# EAGLE design +Z SOLAR PANEL (EAGLE 8.7.0)
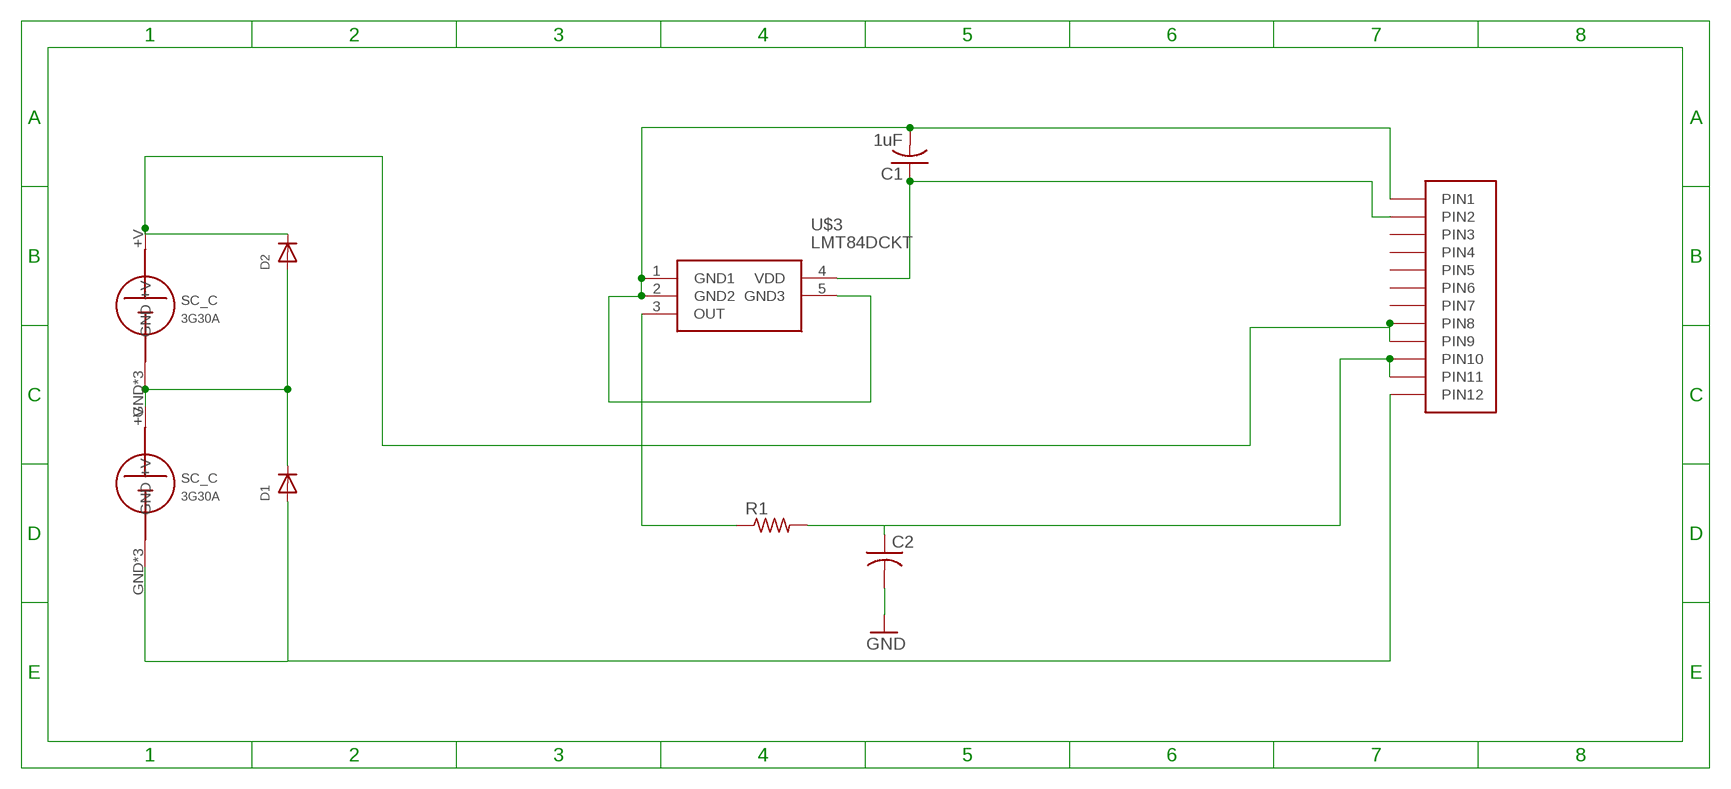
[diagram p0: schematic, sheet 1]

## Parts
C1  1uF  C-USC2012  [C2012]
C2  C-USC2012  [C2012]
D1  DIODE_SOD-123FL  [SOD-123FL]
D2  DIODE_SOD-123FL  [SOD-123FL]
R1  R-US_R0402  [R0402]
U$1  HEADER12PIN  [HEADER12PIN]
U$3  LMT84DCKT  [SOT65P210X110-5N]
U$4  SC_C  [SC_C]
U$5  SC_C  [SC_C]

## Nets
+V: D2.C U$1.P8(PIN8) U$1.P9(PIN9) U$4.+V
+VB: D1.C D2.A U$4.GND U$4.GND1(GND) U$4.GND2(GND) U$5.+V
GND: C1.2 C2.2 D1.A U$1.P1(PIN1) U$1.P12(PIN12) U$3.1(GND1) U$3.2(GND2) U$3.5(GND3) U$5.GND U$5.GND1(GND) U$5.GND2(GND)
N$3: C1.1 U$1.P2(PIN2) U$3.4(VDD)
N$5: R1.1 U$3.3(OUT)
N$6: C2.1 R1.2 U$1.P10(PIN10) U$1.P11(PIN11)
Unconnected: U$1.P3(PIN3) U$1.P4(PIN4) U$1.P5(PIN5) U$1.P6(PIN6) U$1.P7(PIN7)

## Library data of the parts
C1 C2 = adafruit:C-US: CAPACITOR, American symbol
D1 D2 = adafruit:DIODE: Diode SMADIODE - SMA Surface Mount Package 20V 1A Schottky Diode Digikey: 641-1014-6-ND DO-1N4148 - Through Hole Small Current Diode SOD-123 20V 1 A (.5mV Vf) Schottky Diode - Digikey: MBRX120TPMSCT-ND SOD-323 10V 570mA (.38mV Vf, 3ns) Schottky Diode - Digikey: ZLLS410CT-ND SOD-523 30V 30mA Schottky Diode (RB751S-40TE61) - Digikey: RB751S-40TE61CT-ND SOT23-R/W - SOT23 Package (R = Solder Paste/Reflow Ovens, W = Hand-Soldering) BAT54Film 40V 300mA - Digikey: 497-7162-1-ND
R1 = adafruit:R-US_: RESISTOR, American symbol
U$1 = BIRDS:HEADER12PIN
U$3 = LMT84DCKT:LMT84DCKT: 1.5V-Capable, 10 uA Analog Output Temperature Sensor in SC70 and TO-92 Source: Datasheet <http://uk.rs-online.com/web/p/products/8115860>; DESCRIPTION: 1.5V-Capable, 10 uA Analog Output Temperature Sensor in SC70 and TO-92; HEIGHT: 1.1mm; MANUFACTURER_NAME: Texas Instruments; MANUFACTURER_PART_NUMBER: LMT84DCKT; RS_PART_NUMBER: 8115860
U$4 U$5 = SC_C:SC_C

## Board
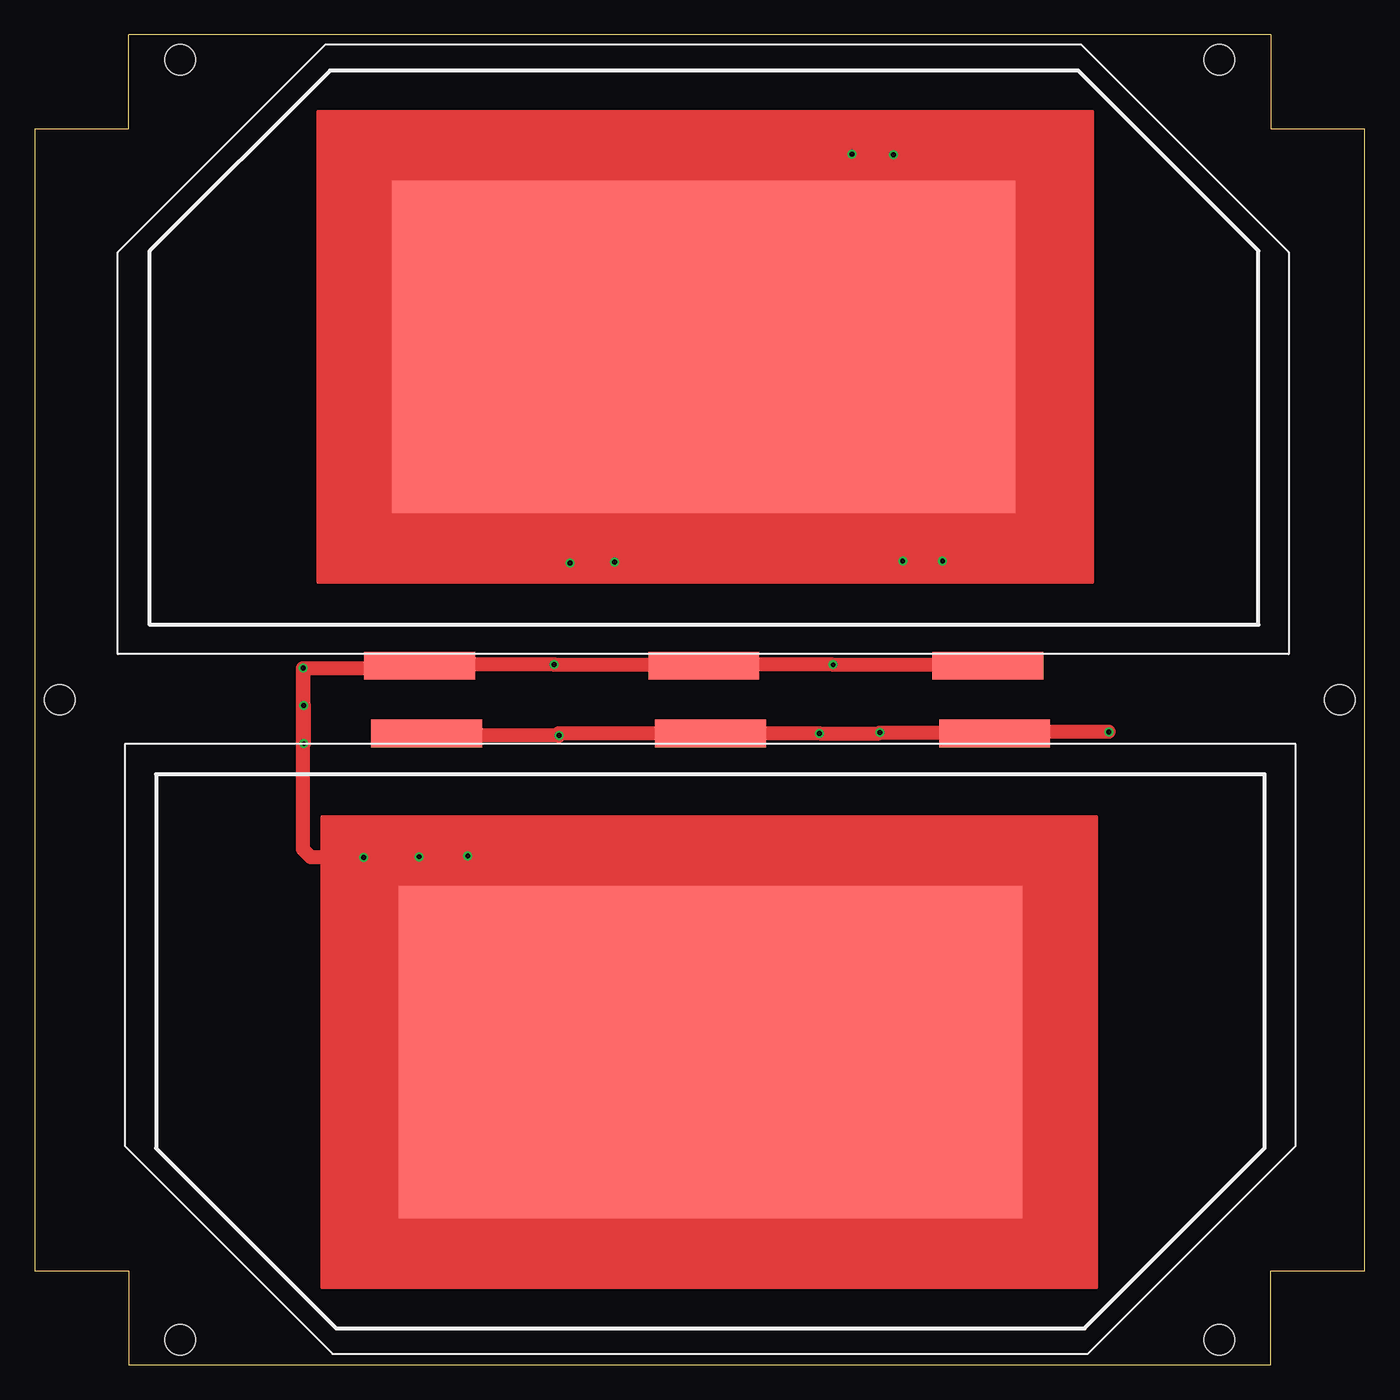
[diagram p1: board, top side]
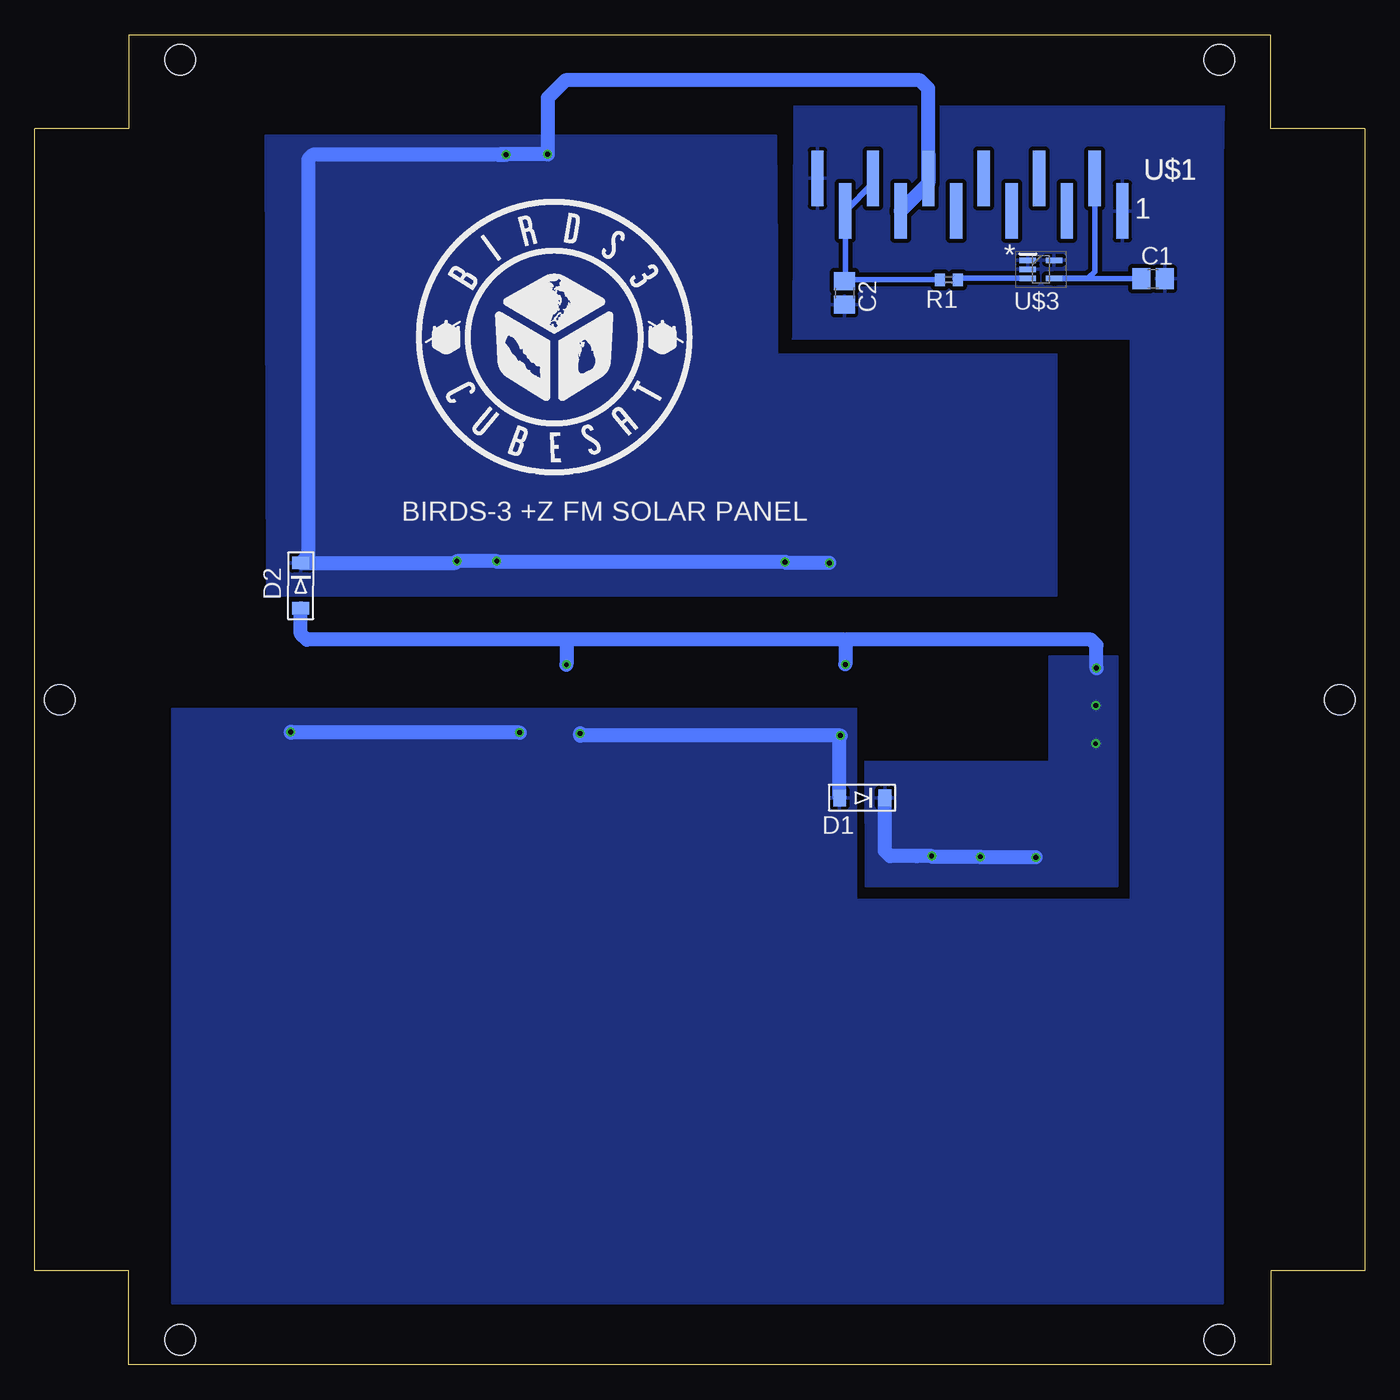
[diagram p2: board, bottom side, seen from below]

Size 96 x 96 mm. Coordinates in mm from the lower left corner, seen from the top.
Outline: 96,6.8 96,89.2 89.2,89.2 89.2,96 6.8,96 6.8,89.2 0,89.2 0,6.8 6.8,6.8 6.8,0 89.2,0 89.2,6.8 96,6.8
Copper layers (1*16): Top 0.035mm / dielectric 1.53mm / Bottom 0.035mm
Design rules "pban_5mil-l2": minimum track width 5mil, minimum drill 0.3mm, track to track 5mil, track to pad 0.229mm, pad to pad 5mil, via to via 5mil, smd to smd 5mil, copper to edge 0.5mm, drill to drill 0.5mm, minimum pad ring 0.15mm, minimum via ring 0.15mm, stop-mask expansion 4mil, vias tented up to drill 0.35mm, thermal gap 10mil
Holes 2.2 mm at 85.5,1.8 10.5,94.2 85.5,94.2 10.5,1.8 94.2,48 1.8,48

### Footprints (pad centres in the part's own frame; a part is rotated, then mirrored left to right if it is on the bottom)
C2012 = smd 1.3 x 1.5: 1 -0.85,0; 2 0.85,0
SOD-123FL = smd 0.91 x 1.22 bottom: A 1.637,0; C -1.637,0
R0402 = smd 0.7 x 0.9: 1 -0.65,0; 2 0.65,0
HEADER12PIN = smd 4 x 0.89: P1 0,0; P2 2.35,2; P3 0,4; P4 2.35,6; P5 0,8; P6 2.35,10; P7 0,12; P8 2.35,14; P9 0,16; P10 2.35,18; P11 0,20; P12 2.35,22
SOT65P210X110-5N = smd 1.2 x 0.4: 1 -0.95,0.65; 2 -0.95,0; 3 -0.95,-0.65; 4 0.95,-0.65; 5 0.95,0.65
SC_C = smd 45 x 24: +V 39.89,20.06 | smd 8 x 2: GND 39.89,-2.94; GND1 60.39,-2.94; GND2 19.39,-2.94

### Placement (x,y rotation side)
C1  15.29,78.38 0 bottom
C2  37.55,77.36 270 bottom
D1  36.27,40.92 0 top
D2  76.79,56.24 270 top
R1  30.02,78.31 180 bottom
U$1  17.5,83.27 90 bottom
U$3  23.38,79.06 0 bottom
U$4  8.4,53.4 0 top
U$5  88.67,42.63 180 top

### Tracks (layer width: path | path; a pad name or v marks a point on that pad's centre or on a via)
+V  (via drill 0.35)
  Top 0.305: U$4.+V 48.29,76.68 v58.98,87.37
  Bottom 1.016: 62.48,87.33 62.44,87.37 v58.98,87.37 58.98,91.42 57.7,92.7 32.1,92.7 31.5,92.1 U$1.P8 | 62.51,87.3 62.48,87.33 | 62.48,87.33 v61.99,87.33 75.93,87.33 76.26,87 76.26,58.41 D2.C 65.65,57.88 v65.53,58 v62.65,58 62.6,57.95 v41.84,57.95 41.76,57.87 v38.64,57.87 | 31.5,87.45 U$1.P8 | U$1.P8 31.5,85.27 U$1.P9
  pour Bottom (isolate 0.305): 42.42,80.19 42.43,72.93 22.26,72.95 22.25,55.49 79.23,55.47 79.33,88.74 42.51,88.74
+VB  (via drill 0.35)
  Top 0.305: U$5.+V 45.74,22.57
  Top 0.61: 68.72,50.53 U$4.GND1 | v57.63,50.53 57.56,50.46 | v19.37,50.29 19.54,50.46 | U$5.+V 34.63,36.72 v31.26,36.72
  Top 1.016: v23.75,36.63 19.94,36.63 19.36,37.21 v19.36,50.28 v19.37,50.29 | v19.37,50.29 27.62,50.29 U$4.GND2 27.88,50.55 v37.49,50.55 37.51,50.53 48.36,50.53 | 48.36,50.53 v57.63,50.53 68.72,50.53 69.63,50.53 69.78,50.68 | 48.36,50.53 U$4.GND | v19.37,50.29 19.37,47.59 v19.42,47.59 v19.42,44.83 v19.43,44.83
  Bottom 0.61: 19.49,50.41 v19.37,50.29 | 27.71,36.63 v27.75,36.67 | 31.21,36.67 v31.26,36.72
  Bottom 1.016: v23.75,36.63 27.71,36.63 | v27.75,36.67 31.21,36.67 | 32.36,36.72 v31.26,36.72 34.26,36.72 34.64,37.1 D1.C | v19.37,50.29 19.37,51.94 19.76,52.33 37.49,52.33 | 57.58,52.33 37.55,52.33 37.49,52.33 | 57.58,52.33 76.37,52.33 76.79,52.75 D2.A | 57.58,52.33 57.63,52.28 v57.63,50.53 | 37.49,52.33 v37.49,50.55
  pour Bottom: 22.81,51.12 22.82,43.52 36.08,43.56 36.06,34.55 17.83,34.55 17.82,51.12
GND  (via drill 0.35)
  Top 1.016: v77.52,45.68 69.28,45.68 69.28,45.63 | 69.28,45.63 U$5.GND2 | 69.28,45.63 v61,45.63 60.94,45.57 v56.63,45.57 U$5.GND | U$5.GND 47.63,45.57 47.63,45.54 48.78,45.54 U$5.GND | U$5.GND 37.84,45.57 v37.84,45.41 28.44,45.41 U$5.GND1
  Bottom 1.016: v56.63,45.57 56.63,45.41 v37.84,45.41 37.91,45.34 D1.A | v61,45.63 77.52,45.63 v77.52,45.68
  pour Bottom (isolate 0.305): 41.27,74.1 41.31,74.06 16.93,74.06 16.93,33.56 36.68,33.56 36.68,47.35 86.1,47.35 86.1,4.45 10.23,4.45 10.23,86.73 10.13,90.8 41.19,90.8
N$3
  Bottom 0.406: U$1.P2 19.5,78.9 19.99,78.41 U$3.4 22.4,78.38 C1.1
N$5
  Bottom 0.406: 29.59,78.41 R1.1 29.27,78.41 U$3.3
N$6
  Bottom 0.406: R1.2 37.45,78.31 C2.1 37.5,78.26 U$1.P11 35.5,85.27 U$1.P10

### Text on the board
bNames: U$1 | U$1 | 1 | * | BIRDS-3 +Z FM SOLAR PANEL